# Altium schematic sheet TAG.SchDoc: TAG Connector
size A4; DocumentNumber: MB1248; Revision: A.2; SheetNumber: 12; SheetTotal: 14; Project: STM32H7-DK
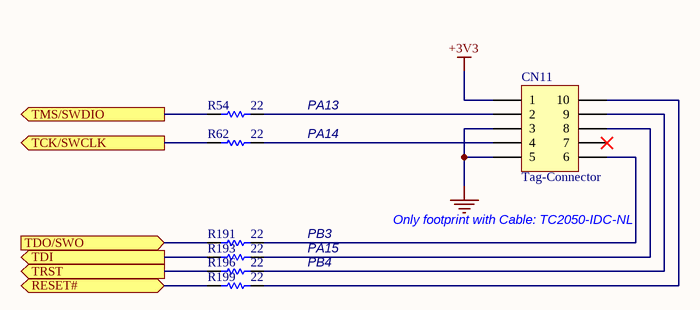
[diagram p0: TAG.SchDoc]

## Parts
CN11  Tag-Connector  [TC2050-IDC-NL]
R54  22  [0603R]
R62  22  [0603R]
R191  22  [0603R]
R193  22  [0603R]
R196  22  [0603R]
R199  22  [0603R]

## Ports
RESET# (bidir), TCK/SWCLK (out), TDI (out), TDO/SWO (in), TMS/SWDIO (out), TRST (out)

## Nets
+3V3: CN11.1
GND: CN11.3 CN11.5
RESET#: R199.2 ; port RESET#
TCK/SWCLK: R62.2 ; port TCK/SWCLK
TDI: R193.2 ; port TDI
TDO/SWO: R191.2 ; port TDO/SWO
TMS/SWDIO: R54.2 ; port TMS/SWDIO
TRST: R196.2 ; port TRST
NetCN11_2: CN11.2 R54.1
NetCN11_4: CN11.4 R62.1
NetCN11_6: CN11.6 R191.1
NetCN11_8: CN11.8 R193.1
NetCN11_9: CN11.9 R196.1
NetCN11_10: CN11.10 R199.1

Not connected (* = marked no-connect by the designer): CN11 7*

## Notes on the sheet
- PA13
- PA14
- PB3
- PA15
- Only footprint with Cable: TC2050-IDC-NL
- PB4
- Title:
- Project:
- Size:
- Date:
- A4
- Reference:
- Sheet:
- Revision:
- of

## Library data of the parts
CN11 = Tag-Connector: Header, 6-Pin, Dual row; Revision: 17-Jul-2002: Re-released for DXP Platform.; Publisher: Altium Limited
R54 R62 R191 R193 R196 R199 = Res1: Resistor; Value: 1K; Published: 8-Jun-2000; Revision: July-2002: Re-released for DXP Platform.; Publisher: Altium Limited